# Altium schematic sheet DCDC_12V_5V_3.3V.SchDoc
size A4; SheetNumber: 1; SheetTotal: 1
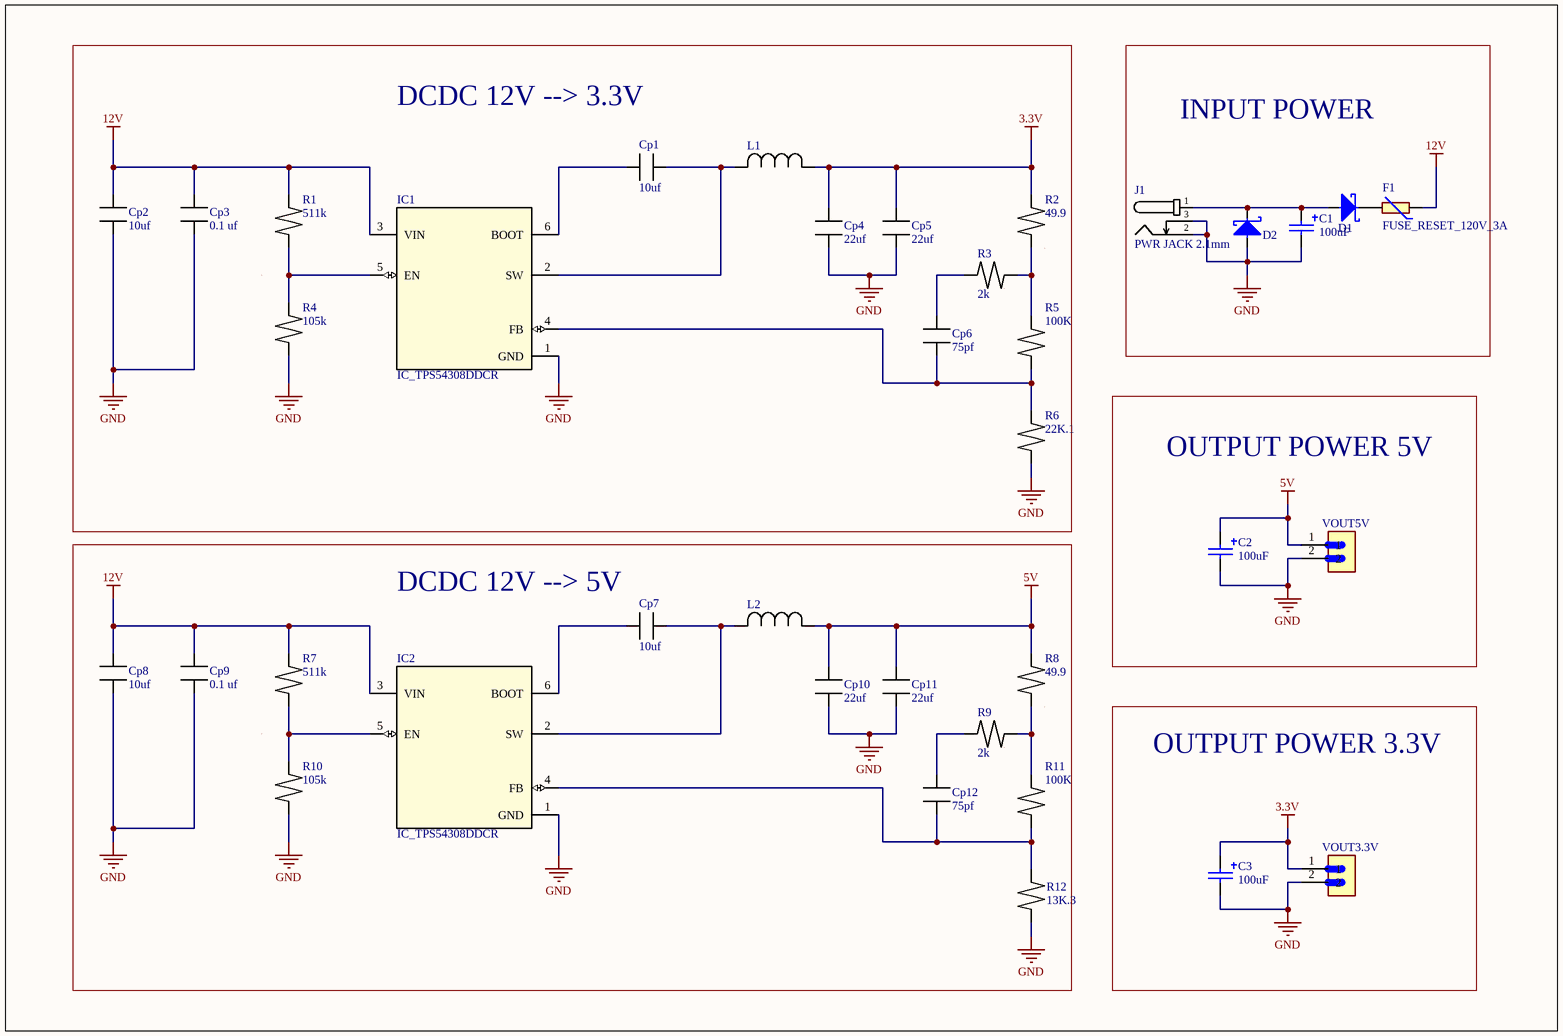
[diagram p0: DCDC_12V_5V_3.3V.SchDoc]

## Parts
C1  value 100uF  [CAP_TH_2.5MM_6.3*12MM]  (hidden comment: 100uF 35V)
C2  value 100uF  [CAP_TH_2.5MM_6.3*12MM]  (hidden comment: 100uF 35V)
C3  value 100uF  [CAP_TH_2.5MM_6.3*12MM]  (hidden comment: 100uF 35V)
Cp1  value 10uf  [Capacitor_0805]  (hidden comment: 10uf 0805)
Cp2  value 10uf  [Capacitor_0805]  (hidden comment: 10uf 0805)
Cp3  value 0.1 uf  [Capacitor_0603]  (hidden comment: 0.1uf 0603)
Cp4  value 22uf  [Capacitor_0805]  (hidden comment: 22uf 0805)
Cp5  value 22uf  [Capacitor_0805]  (hidden comment: 22uf 0805)
Cp6  value 75pf  [Capacitor_0805]  (hidden comment: 75pf 0805)
Cp7  value 10uf  [Capacitor_0805]  (hidden comment: 10uf 0805)
Cp8  value 10uf  [Capacitor_0805]  (hidden comment: 10uf 0805)
Cp9  value 0.1 uf  [Capacitor_0603]  (hidden comment: 0.1uf 0603)
Cp10  value 22uf  [Capacitor_0805]  (hidden comment: 22uf 0805)
Cp11  value 22uf  [Capacitor_0805]  (hidden comment: 22uf 0805)
Cp12  value 75pf  [Capacitor_0805]  (hidden comment: 75pf 0805)
D1  30V 3A  [SMA]  (value not drawn)
D2  30V 3A  [SMA]  (value not drawn)
F1  FUSE_RESET_120V_3A  [FUS_RES_120V_3A]
IC1  IC_TPS54308DDCR  [IC_TPS54308DDCR]
IC2  IC_TPS54308DDCR  [IC_TPS54308DDCR]
J1  PWR JACK 2.1mm  [CON_POWER_BARREL_2.1MM_3CONN]
L1  IND 10UH 3.1A  [Inductor_10uh_3.1A]  (value not drawn)
L2  IND 15UH 3.1A  [Inductor_10uh_3.1A]  (value not drawn)
R1  value 511k  [0603_resistor]  (hidden comment: 511K 0603)
R2  value 49.9  [0603_resistor]  (hidden comment: 49.9 0603)
R3  value 2k  [0603_resistor]  (hidden comment: 2K 0603)
R4  value 105k  [0603_resistor]  (hidden comment: 105K 0603)
R5  value 100K  [0603_resistor]  (hidden comment: 100K 0603)
R6  value 22K.1  [0603_resistor]  (hidden comment: 22K.1 0603)
R7  value 511k  [0603_resistor]  (hidden comment: 511K 0603)
R8  value 49.9  [0603_resistor]  (hidden comment: 49.9 0603)
R9  value 2k  [0603_resistor]  (hidden comment: 2K 0603)
R10  value 105k  [0603_resistor]  (hidden comment: 105K 0603)
R11  value 100K  [0603_resistor]  (hidden comment: 100K 0603)
R12  value 13K.3  [0603_resistor]  (hidden comment: 13K.3 0603)
VOUT3.3V  TERM BLK 2POS  [TERM_BLK_2POS]  (value not drawn)
VOUT5V  TERM BLK 2POS  [TERM_BLK_2POS]  (value not drawn)

## Blocks framed on the sheet
DCDC 12V --> 3.3V: Cp1-Cp6 IC1 L1 R1-R6
INPUT POWER: C1 D1 D2 F1 J1
OUTPUT POWER 5V: C2 VOUT5V
DCDC 12V --> 5V: Cp7-Cp12 IC2 L2 R7-R12
OUTPUT POWER 3.3V: C3 VOUT3.3V

## Nets
3.3V: C3.1 Cp4.2(-) Cp5.2(-) L1.1 R2.2 VOUT3.3V.1
5V: C2.1 Cp10.2(-) Cp11.2(-) L2.1 R8.2 VOUT5V.1
12V: Cp2.2(-) Cp3.2(-) Cp8.2(-) Cp9.2(-) F1.1 IC1.3(VIN) IC2.3(VIN) R1.2 R7.2
GND: C1.2 C2.2 C3.2 Cp2.1(+) Cp3.1(+) Cp4.1(+) Cp5.1(+) Cp8.1(+) Cp9.1(+) Cp10.1(+) Cp11.1(+) D2.2 IC1.1(GND) IC2.1(GND) J1.2 J1.3 R4.1 R6.1 R10.1 R12.1 VOUT3.3V.2 VOUT5V.2
NetC1_1: C1.1 D1.2 D2.1 J1.1
NetCp1_1: Cp1.1(+) IC1.6(BOOT)
NetCp1_2: Cp1.2(-) IC1.2(SW) L1.2
NetCp6_1: Cp6.1(+) IC1.4(FB) R5.1 R6.2
NetCp6_2: Cp6.2(-) R3.1
NetCp7_1: Cp7.1(+) IC2.6(BOOT)
NetCp7_2: Cp7.2(-) IC2.2(SW) L2.2
NetCp12_1: Cp12.1(+) IC2.4(FB) R11.1 R12.2
NetCp12_2: Cp12.2(-) R9.1
NetD1_1: D1.1 F1.2
NetIC1_5: IC1.5(EN) R1.1 R4.2
NetIC2_5: IC2.5(EN) R7.1 R10.2
NetR2_1: R2.1 R3.2 R5.2
NetR8_1: R8.1 R9.2 R11.2

## Library data of the parts
C1-C3 = Cap_100uF_ALU_TH_35V: 100uF 35V ±20% Plugin,D6.3xL12mm Aluminum Electrolytic Capacitors - Leaded ROHS; Manufacturer: HRK; Manufacturer Part Number: 35V100uF CD110; Supplier 1: LCSC; Supplier Part Number 1: C2960381; ComponentLink1Description: LCSC; ComponentLink1URL: https://lcsc.com/product-detail/Aluminum-Electrolytic-Capacitors-Leaded_HRK-35V100uF-CD110_C2960381.html
Cp1 Cp2 Cp7 Cp8 = Capacitor_10uf_0805_50V: CAP CER 10UF 50V X5R 0805; Manufacturer: Murata Electronics; Manufacturer PN: GRM21BR61H106KE43L; Supplier 1: Digi-Key; Supplier Part Number 1: 490-18663-1-ND; ComponentLink1Description: Link; ComponentLink1URL: https://www.digikey.com/en/products/detail/murata-electronics/GRM21BR61H106KE43L/10326316
Cp3 Cp9 = Capacitor_0.1uf_0603_50V: CAP CER 0.1UF 50V X7R 0603; Manufacturer: KYOCERA AVX; Manufacturer PN: CC0603KRX7R9BB104; Supplier 1: Digi-Key; Supplier Part Number 1: 311-1344-1-ND; ComponentLink1Description: Link; ComponentLink1URL: https://www.digikey.com/en/products/detail/yageo/CC0603KRX7R9BB104/2103082
Cp4 Cp5 Cp10 Cp11 = Capacitor_22uf_0805_50V_1: CAP0805 X5R 22UF 20% 25V; Manufacturer: Cal-Chip Electronics, Inc.; Manufacturer PN: GMC21X5R226M25NT; Supplier 1: Digi-Key; Supplier Part Number 1: 4713-GMC21X5R226M25NTCT-ND; ComponentLink1Description: Link; ComponentLink1URL: https://www.digikey.com/en/products/detail/cal-chip-electronics-inc/GMC21X5R226M25NT/18151071
Cp6 Cp12 = Capacitor_75pf_0805_50V: CAP CER 75PF 50V C0G/NPO 0805; Manufacturer: YAGEO; Manufacturer PN: CC0805JRNPO9BN750; Supplier 1: Digi-Key; Supplier Part Number 1: 311-4243-1-ND; ComponentLink1Description: Link; ComponentLink1URL: https://www.digikey.com/en/products/detail/cal-chip-electronics-inc/GMC21X5R226M25NT/18151071
D1 D2 = D_Schottky_40V_3A_SMA: 40V Independent 3A 550mV@3A SMA Schottky Diodes ROHS; Manufacturer: TDSEMIC; Manufacturer Part Number: SS34-TD; Supplier 1: LCSC; Supplier Part Number 1: C46550832; ComponentLink1Description: LCSC; ComponentLink1URL: https://lcsc.com/product-detail/Schottky-Diodes_TDSEMIC-SS34-TD_C46550832.html
F1 = FUSE_RESET_120V_3A: PTC RESET FUSE 120V 300MA RADIAL; Manufacturer: Bel Fuse Inc.; Manufacturer PN: 0ZRM0030FF1E; Supplier 1: Digi-Key; Supplier Part Number 1: 5923-0ZRM0030FF1E-ND; ComponentLink1Description: Link; ComponentLink1URL: https://www.digikey.com/en/products/detail/bel-fuse-inc/0ZRM0030FF1E/1965823
IC1 IC2 = IC_TPS54308DDCR: IC REG BUCK ADJ 3A SOT23; Manufacturer: Texas Instruments; Manufacturer PN: TPS54308DDCR; Supplier 1: Digi-Key; Supplier Part Number 1: 296-47880-1-ND; ComponentLink1Description: Link; ComponentLink1URL: https://www.digikey.com/en/products/detail/texas-instruments/TPS54308DDCR/7400123
J1 = Con_Power_Jack_2.1mm_3pins: CONN PWR JACK 2X5.5MM SOLDER; Manufacturer: HCTL; Manufacturer Part Number: HC-DC-005-2.0T; Supplier 1: LCSC; Supplier Part Number 1: C3010533; ComponentLink1Description: LCSC; ComponentLink1URL: https://www.lcsc.com/product-detail/AC-DC-Power-Connectors_HCTL-HC-DC-005-2-0T_C3010533.html
L1 = IND_10UH_3.1A: FIXED IND 10UH 3.1A 44.2 MOHM; Manufacturer: Taiyo Yuden; Manufacturer PN: NRS8040T100MJGJ; Supplier 1: Digi-Key; Supplier Part Number 1: 587-2972-1-ND; ComponentLink1Description: Link; ComponentLink1URL: https://www.digikey.com/en/products/detail/taiyo-yuden/NRS8040T100MJGJ/2666010
L2 = IND_15UH_3.1A: FIXED IND 15UH 3.1A 44 MOHM SMD; Manufacturer: Eaton - Electronics Division; Manufacturer PN: DRA124-150-R; Supplier 1: Digi-Key; Supplier Part Number 1: 283-DRA124-150-RCT-ND; ComponentLink1Description: Link; ComponentLink1URL: N4IgjCBcpgnAHLKoDGUBmBDANgZwKYA0IA9lANogAMIAugL7EBMV8A7MiGpFnkaRXABWAAQBWgBJ1iABwAuUEAFUAdgEs5AeXQBZfJlwBXAE74QjEC3jxO3XgWJlIlAMwA6MCICC0kPMWqGtp6BiZmFgC0QrYYOA4CzpZ0kUjQXFByxob8Tq4gxBAMxBFMMZCZ2Y6C0Qz09EA
R1 R7 = RES_511K_0603_1/10W_1%_1_1_1: RES 511K OHM 1% 1/10W 0603; Manufacturer: Cal-Chip Electronics, Inc.; Manufacturer PN: RM06F5113CT; Supplier 1: Digi-Key; Supplier Part Number 1: 4713-RM06F5113CT-ND; ComponentLink1Description: Link; ComponentLink1URL: https://www.digikey.com/en/products/detail/cal-chip-electronics-inc/RM06F5113CT/26811769
R2 R8 = RES_49.9_0603_1/10W_1%: RES 49.9 OHM 1% 1/10W 0603; Manufacturer: YAGEO; Manufacturer PN: RC0603FR-0749R9L; Supplier 1: Digi-Key; Supplier Part Number 1: 311-49.9HRCT-ND; ComponentLink1Description: Link; ComponentLink1URL: https://www.digikey.com/en/products/detail/yageo/RC0603FR-0749R9L/727264
R3 R9 = RES_2K_0603_1/10W_1%_1: RES 2K OHM 1% 1/10W 0603; Manufacturer: NIC Components Corp; Manufacturer PN: NRC06F2001TRF; Supplier 1: Digi-Key; Supplier Part Number 1: 4988-NRC06F2001TRFCT-ND; ComponentLink1Description: Link; ComponentLink1URL: https://www.digikey.com/en/products/detail/nic-components-corp/NRC06F2001TRF/18896030
R4 R10 = RES_105K_0603_1/10W_1%_1_1: RES 105K OHM 1% 1/10W 0603; Manufacturer: Cal-Chip Electronics, Inc.; Manufacturer PN: RM06F1053CT; Supplier 1: Digi-Key; Supplier Part Number 1: 4713-RM06F1053CT-ND; ComponentLink1Description: Link; ComponentLink1URL: https://www.digikey.com/en/products/detail/cal-chip-electronics-inc/RM06F1053CT/26772973
R5 R11 = RES_100K_0603_1/10W_1%_1: RES 100K OHM 1% 1/10W 0603; Manufacturer: YAGEO; Manufacturer PN: RC0603FR-07100KL; Supplier 1: Digi-Key; Supplier Part Number 1: 311-100KHRCT-ND; ComponentLink1Description: Link; ComponentLink1URL: https://www.digikey.com/en/products/detail/yageo/RC0603FR-07100KL/726889
R6 = RES_22K.1_0603_1/10W_1%_1_1: RES 22K.1 OHM 1% 1/10W 0603; Manufacturer: YAGEO; Manufacturer PN: RC0603FR-0722K1L; Supplier 1: Digi-Key; Supplier Part Number 1: 311-22.1KHRCT-ND; ComponentLink1Description: Link; ComponentLink1URL: https://www.digikey.com/en/products/detail/yageo/RC0603FR-0722K1L/727058
R12 = RES_13K.3_0603_1/10W_1%_: RES 13.3K OHM 1% 1/10W 0603; Manufacturer: Stackpole Electronics Inc; Manufacturer PN: RMCF0603FT13K3; Supplier 1: Digi-Key; Supplier Part Number 1: RMCF0603FT13K3CT-ND; ComponentLink1Description: Link; ComponentLink1URL: https://www.digikey.com/en/products/detail/stackpole-electronics-inc/RMCF0603FT13K3/1761279
VOUT3.3V VOUT5V = TERM_BLK_2POS: TERM BLK 2POS SIDE ENT 3.5MM PCB; Manufacturer: On Shore Technology Inc.; Manufacturer PN: OSTTE020104; Supplier 1: Digi-Key; Supplier Part Number 1: ED2740-ND; ComponentLink1Description: Link; ComponentLink1URL: https://www.digikey.com/en/products/detail/on-shore-technology-inc/OSTTE020104/2351816?s=N4IgTCBcDaIPYGcAuSCmAGM6CM6AsIAugL5A